# EAGLE schematic schematicDiagramReceiverBoard (EAGLE 8.5.0)
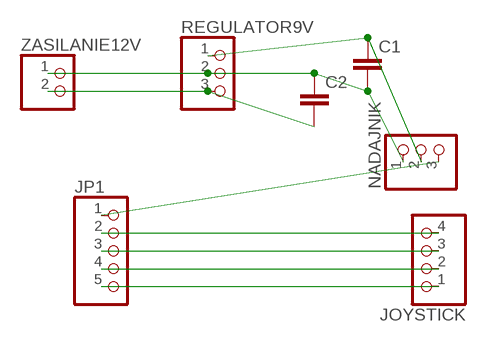
[diagram p0: schematic, sheet 1]

## Parts
C1  C2,5-3  [C2.5-3]
C2  C2,5-3  [C2.5-3]
JOYSTICK  PINHD-1X4  [1X04]
JP1  PINHD-1X5  [1X05]
NADAJNIK  PINHD-1X3  [1X03]
REGULATOR9V  PINHD-1X3  [1X03]
ZASILANIE12V  PINHD-1X2  [1X02]

## Nets
N$1: C1.2 C2.1 NADAJNIK.1 REGULATOR9V.2 ZASILANIE12V.1
N$2: C2.2 REGULATOR9V.3 ZASILANIE12V.2
N$3: JOYSTICK.1 JP1.5
N$4: JOYSTICK.2 JP1.4
N$5: JOYSTICK.3 JP1.3
N$6: JOYSTICK.4 JP1.2
N$7: JP1.1 NADAJNIK.3
N$8: C1.1 NADAJNIK.2 REGULATOR9V.1

## Library data of the parts
C1 C2 = capacitor-wima:C: CAPACITOR naming: grid - package width
JOYSTICK = pinhead:PINHD-1X4: PIN HEADER
JP1 = pinhead:PINHD-1X5: PIN HEADER
NADAJNIK REGULATOR9V = pinhead:PINHD-1X3: PIN HEADER
ZASILANIE12V = pinhead:PINHD-1X2: PIN HEADER